# EAGLE design espslider (EAGLE 7.6.0)
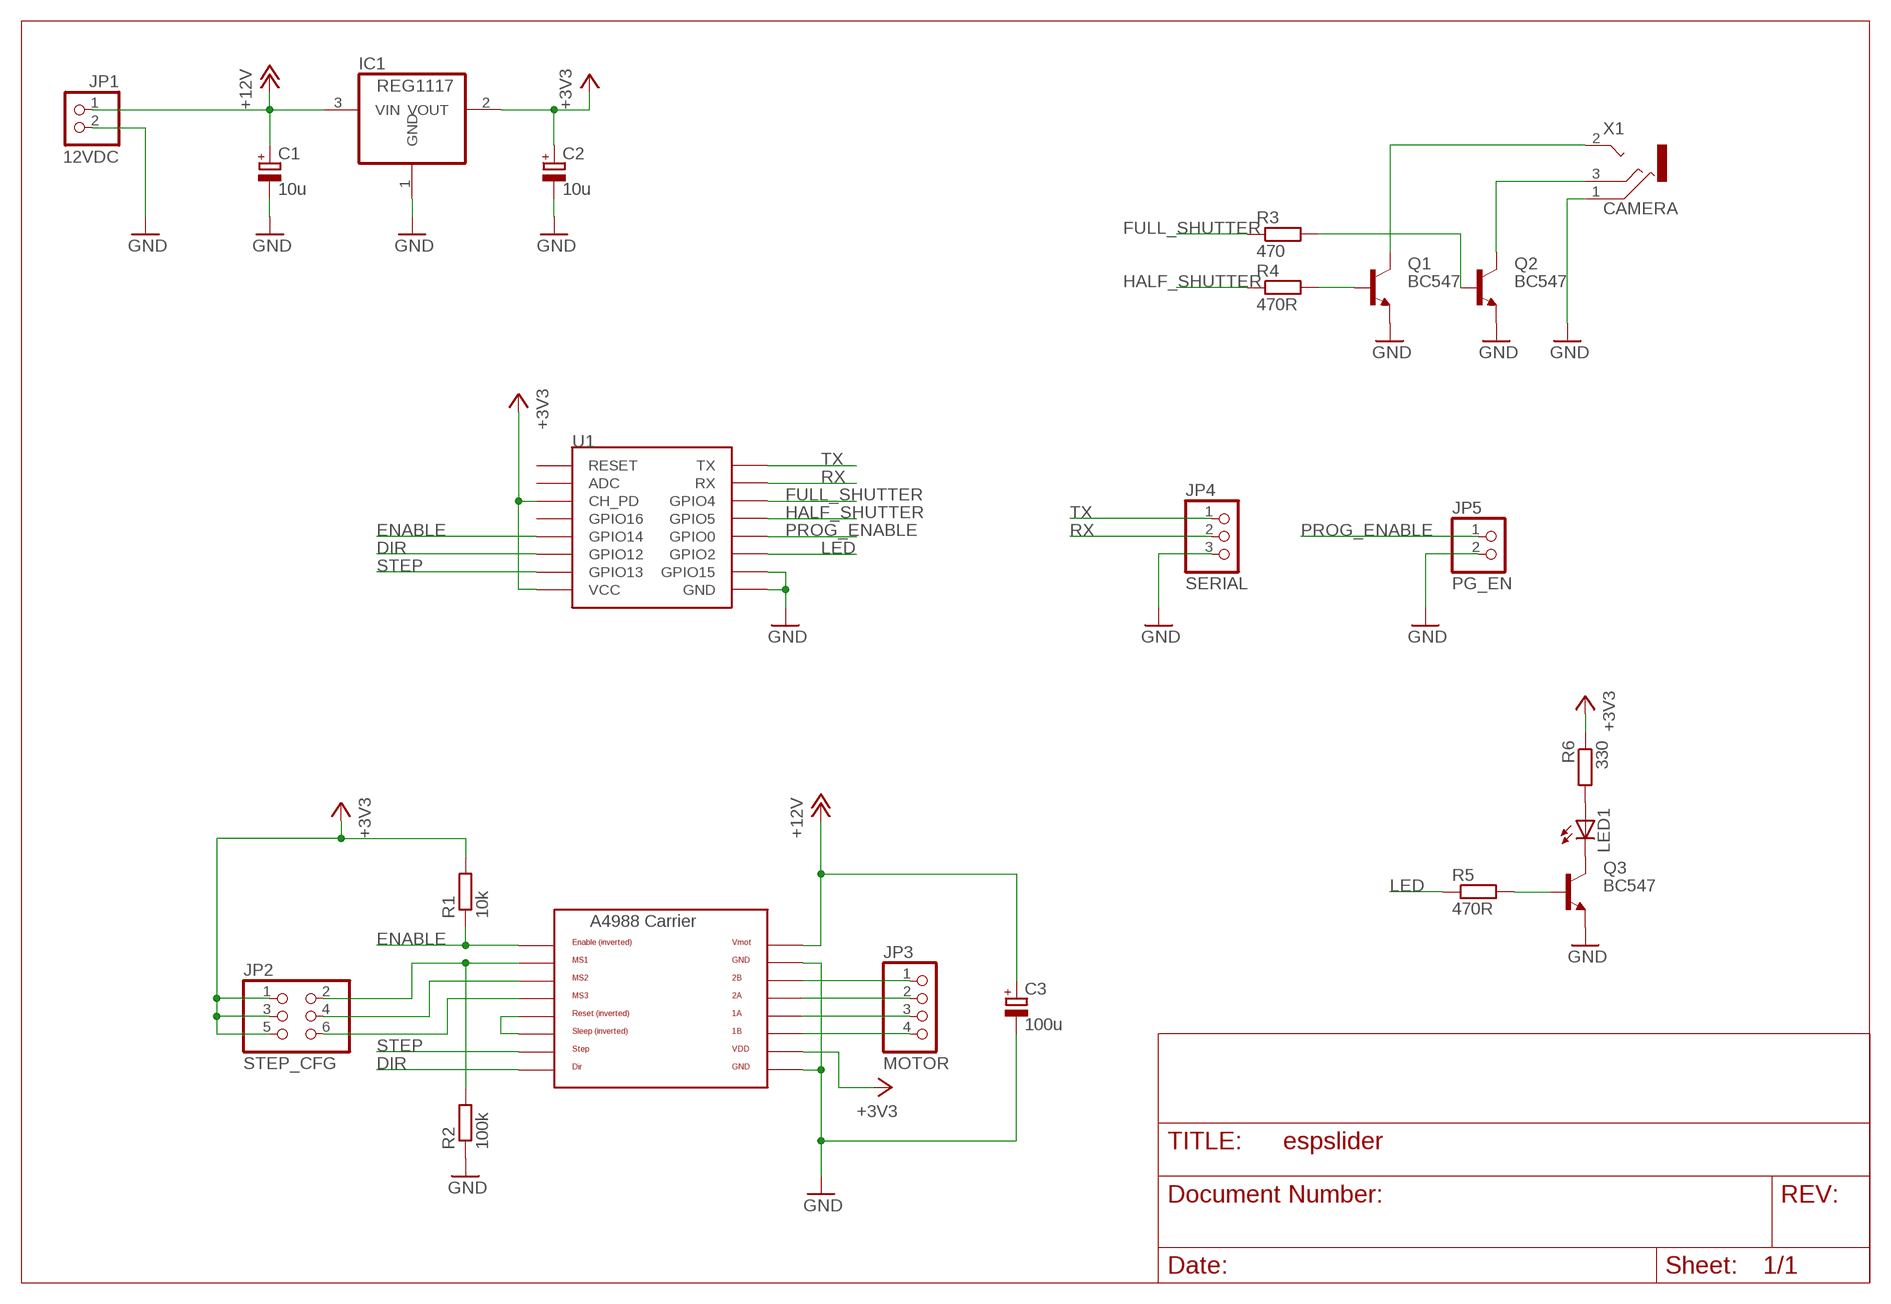
[diagram p0: schematic, sheet 1]

## Parts
C1  10u  CPOL-EUE5-5  [E5-5]
C2  10u  CPOL-EUE5-5  [E5-5]
C3  100u  CPOL-EUE5-5  [E5-5]
IC1  REG1117  [SOT223]
JP1  12VDC  PINHD-1X2  [1X02]
JP2  STEP_CFG  PINHD-2X3  [2X03]
JP3  MOTOR  PINHD-1X4  [1X04]
JP4  SERIAL  PINHD-1X3  [1X03]
JP5  PG_EN  PINHD-1X2  [1X02]
LED1  LED3MM  [LED3MM]
Q1  BC547  [TO92]
Q2  BC547  [TO92]
Q3  BC547  [TO92]
R1  10k  R-EU_0207/7  [0207/7]
R2  100k  R-EU_0207/15  [0207/15]
R3  470  R-EU_0207/7  [0207/7]
R4  470R  R-EU_0207/7  [0207/7]
R5  470R  R-EU_0207/7  [0207/7]
R6  330  R-EU_0207/7  [0207/7]
U1  ESP12SMD  [ESP12-SMD]
U2  A4988BREAKOUT  [A4988BREAKOUT]
X1  CAMERA  1501_04  [1501_05]

## Nets
+3V3: C2.+ IC1.2(VOUT) JP2.1 JP2.3 JP2.5 R1.2 R6.1 U1.CH_PD U1.VCC U2.VDD
+12V: C1.+ C3.+ IC1.3(VIN) JP1.1 U2.VMOT
DIR: U1.GPIO12 U2.DIR
ENABLE: R1.1 U1.GPIO14 U2.EN
FULL_SHUTTER: R3.1 U1.GPIO4
GND: C1.- C2.- C3.- IC1.1(GND) JP1.2 JP4.3 JP5.2 Q1.1(E) Q2.1(E) Q3.1(E) R2.1 U1.GND U1.GPIO15 U2.GND U2.GND@0(GND) X1.1
HALF_SHUTTER: R4.1 U1.GPIO5
LED: R5.1 U1.GPIO2
N$1: Q2.3(C) X1.3
N$2: Q2.2(B) R3.2
N$3: Q1.2(B) R4.2
N$4: Q1.3(C) X1.2
N$5: JP2.2 R2.2 U2.MS1
N$6: JP2.4 U2.MS2
N$7: JP2.6 U2.MS3
N$8: LED1.A R6.2
N$9: U2.RST U2.SLP(SLEEP)
N$10: JP3.1 U2.2B
N$11: JP3.2 U2.2A
N$12: JP3.3 U2.1A
N$13: JP3.4 U2.1B
N$14: LED1.K(C) Q3.3(C)
N$15: Q3.2(B) R5.2
PROG_ENABLE: JP5.1 U1.GPIO0
RX: JP4.2 U1.RXD0(RX)
STEP: U1.GPIO13 U2.STEP
TX: JP4.1 U1.TXD0(TX)
Unconnected: U1.ADC U1.GPIO16 U1.RESET

## Library data of the parts
C1 C2 = rcl:CPOL-EU: POLARIZED CAPACITOR, European symbol; MF: KEMET; MPN: T491C107K010AT; OC_NEWARK: 97H5564
C3 = rcl:CPOL-EU: POLARIZED CAPACITOR, European symbol; OC_NEWARK: unknown
IC1 = burr-brown:REG1117: 800mA and 1A Low Dropout (LDO) Positive Regulator 1.8V, 2.5V, 2.85V, 3.3V, 5V, and Adj; MPN: REG1117; OC_FARNELL: 1097566; OC_NEWARK: 14P6981
JP1 JP5 = pinhead:PINHD-1X2: PIN HEADER; OC_NEWARK: unknown
JP2 = pinhead:PINHD-2X3: PIN HEADER; OC_NEWARK: unknown
JP3 = pinhead:PINHD-1X4: PIN HEADER; OC_NEWARK: unknown
JP4 = pinhead:PINHD-1X3: PIN HEADER; OC_NEWARK: unknown
LED1 = led:LED: LED OSRAM: - CHIPLED LG R971, LG N971, LY N971, LG Q971, LY Q971, LO R971, LY R971 LH N974, LH R974 LS Q976, LO Q976, LY Q976 LO Q996 - Hyper CHIPLED LW Q18S LB Q993, LB Q99A, LB R99A - SideLED LS A670, LO A670, LY A670, LG A670, LP A670 LB A673, LV A673, LT A673, LW A673 LH A674 LY A675 LS A676, LA A676, LO A676, LY A676, LW A676 LS A679, LY A679, LG A679 - Hyper Micro SIDELED® LS Y876, LA Y876, LO Y876, LY Y876 LT Y87S - SmartLED LW L88C, LW L88S LB L89C, LB L89S, LG L890 LS L89K, LO L89K, LY L89K LS L896, LA L896, LO L896, LY L896 - TOPLED LS T670, LO T670, LY T670, LG T670, LP T670 LSG T670, LSP T670, LSY T670, LOP T670, LYG T670 LG T671, LOG T671, LSG T671 LB T673, LV T673, LT T673, LW T673 LH T674 LS T676, LA T676, LO T676, LY T676, LB T676, LH T676, LSB T676, LW T676 LB T67C, LV T67C, LT T67C, LS T67K, LO T67K, LY T67K, LW E67C LS E67B, LA E67B, LO E67B, LY E67B, LB E67C, LV E67C, LT E67C LW T67C LS T679, LY T679, LG T679 LS T770, LO T770, LY T770, LG T770, LP T770 LB T773, LV T773, LT T773, LW T773 LH T774 LS E675, LA E675, LY E675, LS T675 LS T776, LA T776, LO T776, LY T776, LB T776 LHGB T686 LT T68C, LB T68C - Hyper Mini TOPLED® LB M676 - Mini TOPLED Santana® LG M470 LS M47K, LO M47K, LY M47K Source: http://www.osram.convergy.de LUXEON: - LUMILED® LXK2-PW12-R00, LXK2-PW12-S00, LXK2-PW14-U00, LXK2-PW14-V00 LXK2-PM12-R00, LXK2-PM12-S00, LXK2-PM14-U00 LXK2-PE12-Q00, LXK2-PE12-R00, LXK2-PE12-S00, LXK2-PE14-T00, LXK2-PE14-U00 LXK2-PB12-K00, LXK2-PB12-L00, LXK2-PB12-M00, LXK2-PB14-N00, LXK2-PB14-P00, LXK2-PB14-Q00 LXK2-PR12-L00, LXK2-PR12-M00, LXK2-PR14-Q00, LXK2-PR14-R00 LXK2-PD12-Q00, LXK2-PD12-R00, LXK2-PD12-S00 LXK2-PH12-R00, LXK2-PH12-S00 LXK2-PL12-P00, LXK2-PL12-Q00, LXK2-PL12-R00 Source: www.luxeon.com KINGBRIGHT: KA-3528ASYC Source: www.kingbright.com; OC_NEWARK: unknown
Q1-Q3 = transistor-npn:BC547*: NPN Transistor; OC_NEWARK: unknown
R1-R6 = rcl:R-EU_: RESISTOR, European symbol; OC_NEWARK: unknown
U1 = esp8266modules:ESP12: ESP8266 Wifi module 12; OC_NEWARK: unknown
U2 = RepRapjr:A4988BREAKOUT; OC_NEWARK: unknown
X1 = con-lumberg:1501_0*: Jack connectors according to JISC 6560, 2.5 mm Klinkensteckverbinder nach JISC 6560, 2,5 mm Source: http://www.lumberg.com/Produkte/PDFs/1501_05.pdfedit 1501_03 http://www.lumberg.com/Produkte/PDFs/1501_06.pdf; OC_FARNELL: 1216977; OC_NEWARK: unknown

## Board
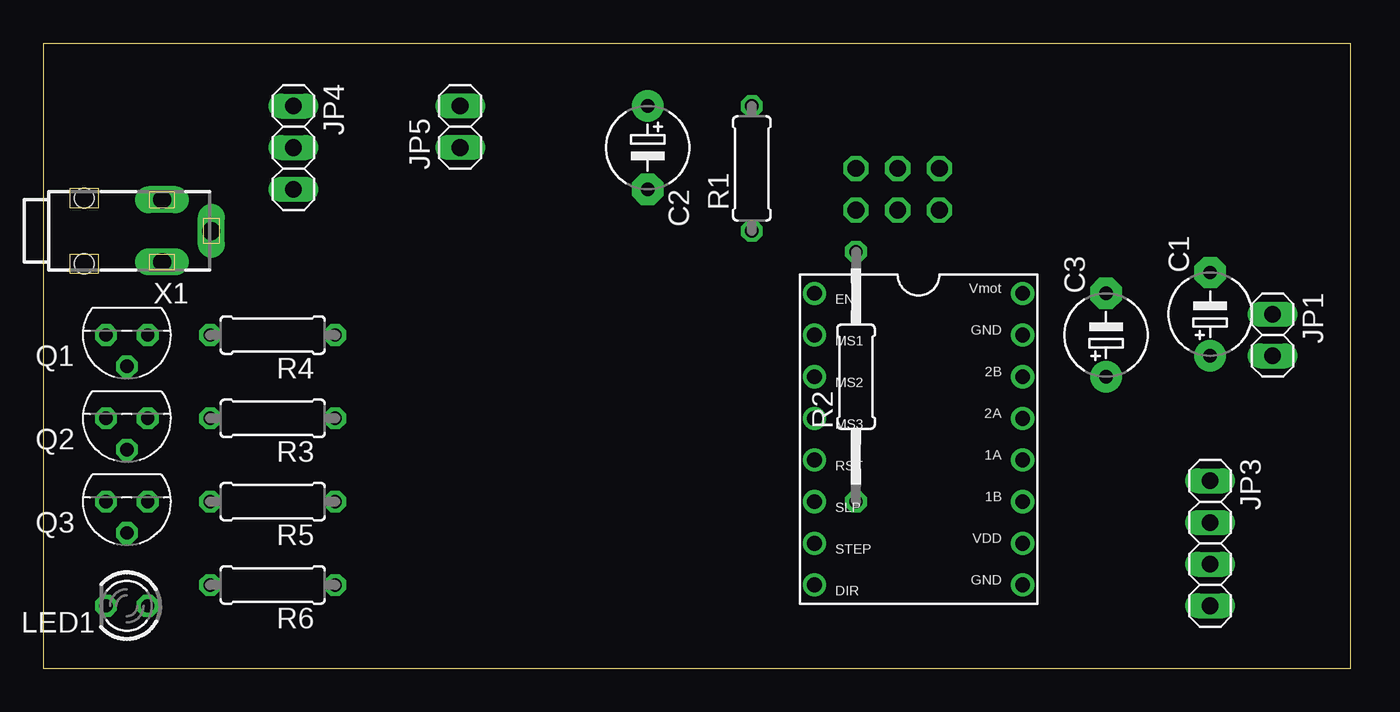
[diagram p1: board, top side]
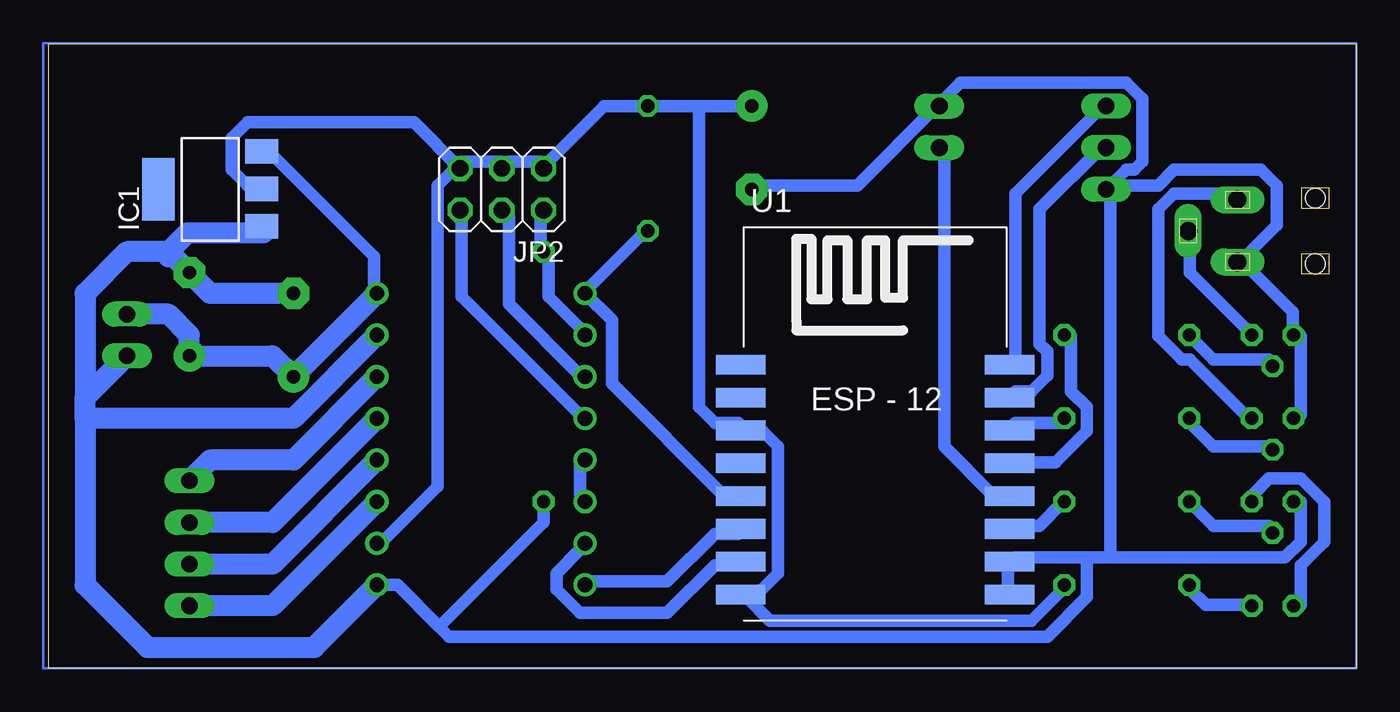
[diagram p2: board, bottom side, seen from below]

Size 79.68 x 38.09 mm. Coordinates in mm from the lower left corner, seen from the top.
Outline: 0,0 79.68,0 79.68,38.09 0,38.09 0,0
Copper layers (1*16): Top 0.035mm / dielectric 1.5mm / Bottom 0.035mm
Design rules "default *": minimum track width 30mil, minimum drill 24mil, track to track 8mil, track to pad 8mil, pad to pad 8mil, via to via 8mil, smd to smd 8mil, copper to edge 40mil, drill to drill 8mil, minimum pad ring 10mil, minimum via ring 8mil, stop-mask expansion 4mil, vias tented up to drill 0mil, thermal gap 10mil

### Footprints (pad centres in the part's own frame; a part is rotated, then mirrored left to right if it is on the bottom)
E5-5 = drill 0.813 pad 1.905: + -2.54,0 | drill 0.813 pad 1.905 octagon: - 2.54,0
SOT223 = smd 1.499 x 2.007: 1 -2.261,-3.15; 2 0.025,-3.15; 3 2.311,-3.15 | smd 3.81 x 2.007: 4 0,3.15
1X02 = drill 1.016 long: 1 -1.27,0; 2 1.27,0
2X03 = drill 1.016 octagon: 1 -2.54,-1.27; 2 -2.54,1.27; 3 0,-1.27; 4 0,1.27; 5 2.54,-1.27; 6 2.54,1.27
1X04 = drill 1.016 long: 1 -3.81,0; 2 -1.27,0; 3 1.27,0; 4 3.81,0
1X03 = drill 1.016 long: 1 -2.54,0; 2 0,0; 3 2.54,0
LED3MM = drill 0.813 octagon: A -1.27,0; K 1.27,0
TO92 = drill 0.813 octagon: 1 1.27,0; 2 0,1.905; 3 -1.27,0
0207/7 = drill 0.813 octagon: 1 -3.81,0; 2 3.81,0
0207/15 = drill 0.813 octagon: 1 -7.62,0; 2 7.62,0
ESP12-SMD = smd 3 x 1.2: ADC -8.3,3.8; CH_PD -8.3,1.8; GND 8.1,-8.2; GPIO0 8.1,-2.2; GPIO2 8.1,-4.2; GPIO4 8.1,1.8; GPIO5 8.1,-0.2; GPIO12 -8.3,-4.2; GPIO13 -8.3,-6.2; GPIO14 -8.3,-2.2; GPIO15 8.1,-6.2; GPIO16 -8.3,-0.2; RESET -8.3,5.8; RXD0 8.1,3.8; TXD0 8.1,5.8; VCC -8.3,-8.2
A4988BREAKOUT = drill 0.9: 1A 8.89,1.27; 1B 11.43,1.27; 2A 6.35,1.27; 2B 3.81,1.27; DIR 16.51,-11.43; EN -1.27,-11.43; GND 16.51,1.27; GND@0 1.27,1.27; MS1 1.27,-11.43; MS2 3.81,-11.43; MS3 6.35,-11.43; RST 8.89,-11.43; SLP 11.43,-11.43; STEP 13.97,-11.43; VDD 13.97,1.27; VMOT -1.27,1.27
1501_05 = drill 1.1 pad 1.4 long: 1 -1.9,-8.5; 2 0,-11.5; 3 1.9,-8.5 | hole 1.2: -2,-3.75; 2,-3.75

### Placement (x,y rotation side)
C1  71.12,21.59 90 top
C2  36.83,31.75 270 top
C3  64.77,20.32 90 top
IC1  69.85,29.21 90 bottom
JP1  74.93,20.32 270 top
JP2  52.07,29.21 180 bottom
JP3  71.12,7.62 270 top
JP4  15.24,31.75 270 top
JP5  25.4,33.02 90 top
LED1  5.08,3.81 180 top
Q1  5.08,20.32 180 top
Q2  5.08,15.24 180 top
Q3  5.08,10.16 180 top
R1  43.18,30.48 90 top
R2  49.53,17.78 90 top
R3  13.97,15.24 180 top
R4  13.97,20.32 180 top
R5  13.97,10.16 180 top
R6  13.97,5.08 180 top
U1  29.21,12.7 0 bottom
U2  58.42,21.59 270 top
X1  -1.27,26.67 90 top

### Tracks (layer width: path | path; a pad name or v marks a point on that pad's centre or on a via)
+3V3
  Bottom 0.762: R6.1 17.86,4.83 19.79,2.9 35.71,2.9 37.16,4.34 U1.VCC 36.68,4.34 35.23,5.79 35.23,13.51 36.2,14.48 37.16,14.48 U1.CH_PD 37.64,14.96 39.09,14.96 40.06,15.93 40.06,34.27 | 40.06,34.27 37.16,34.27 C2.+ | 40.06,34.27 42.95,34.27 R1.2 43.43,34.27 45.85,34.27 49.23,30.89 JP2.1 49.71,30.89 51.64,30.89 JP2.3 52.12,30.89 54.53,30.89 JP2.5 | JP2.5 57.43,33.3 67.56,33.3 68.53,32.33 68.53,30.4 67.56,29.44 67.08,29.44 IC1.2 | U2.VDD 59.36,7.72 55.98,11.1 55.98,29.44 55.02,30.4 JP2.5
+12V
  Bottom 0.762: IC1.3 66.6,31.37 66.12,31.37 59.84,25.09 59.84,23.16 U2.VMOT
  Bottom 1.27: U2.VMOT C3.+ 66.04,19.05 C1.+ 71.12,20.32 72.39,21.59 JP1.1
DIR
  Bottom 0.762: U2.DIR 46.81,5.31 41.99,5.31 39.09,8.2 37.64,8.2 U1.GPIO12
ENABLE
  Bottom 0.762: R1.1 43.43,26.54 46.81,23.16 U2.EN 45.36,21.23 45.36,17.37 38.61,10.62 37.64,10.62 U1.GPIO14
FULL_SHUTTER
  Bottom 0.762: R3.1 17.86,14.96 20.75,14.96 U1.GPIO4
GND
  Bottom 0.762: 16.41,6.76 20.75,6.76 U1.GPIO15 21.23,6.27 21.23,4.83 U1.GND | 16.41,6.76 14.96,6.76 | 14.96,6.76 4.34,6.76 3.38,7.72 3.38,10.13 Q3.1 | Q2.1 3.38,15.44 3.38,20.27 Q1.1 3.86,20.75 3.86,21.72 6.76,24.61 X1.1 6.76,25.09 4.83,27.03 4.83,29.44 5.79,30.4 11.1,30.4 12.06,29.44 14.96,29.44 | 14.96,6.76 14.96,28.96 JP4.3 14.96,29.44 | 66.6,26.54 IC1.1 | 14.96,29.44 13.99,30.4 13.51,30.4 13.03,30.89 13.03,34.75 13.99,35.71 24.13,35.71 25.09,34.75 JP5.2 25.58,34.27 30.4,29.44 36.68,29.44 C2.- | 16.41,6.76 16.41,4.34 18.82,1.93 55.27,1.93 55.88,2.54 | 72.39,25.09 72.39,25.4 | R2.1 49.53,8.89 55.88,2.54 | U2.GND 58.42,5.08 55.88,2.54
  Bottom 1.27: 77.47,15.24 77.47,5.08 73.66,1.27 63.5,1.27 U2.GND | U2.GND@0 64.77,15.24 77.47,15.24 | 77.47,15.24 77.47,16.51 | 77.47,16.51 JP1.2 | 66.6,26.54 71.25,26.54 72.39,25.4 74.93,25.4 77.47,22.86 77.47,16.51 | 72.39,25.09 72.08,25.09 C1.- 69.85,22.86 C3.-
HALF_SHUTTER
  Bottom 0.762: R4.1 17.37,20.27 17.37,16.89 16.41,15.93 16.41,14.48 18.34,12.55 20.75,12.55 U1.GPIO5
LED
  Bottom 0.762: R5.1 17.86,10.13 19.3,8.69 20.75,8.69 U1.GPIO2
N$1
  Bottom 0.762: Q2.3 6.76,15.44 10.13,18.82 10.62,18.82 12.06,20.27 12.06,27.99 11.1,28.96 7.24,28.96 X1.3
N$2
  Bottom 0.762: Q2.2 5.31,13.51 8.69,13.51 10.13,14.96 R3.2
N$3
  Bottom 0.762: Q1.2 5.31,18.82 8.69,18.82 10.13,20.27 R4.2
N$4
  Bottom 0.762: Q1.3 6.76,20.75 10.13,24.13 10.13,26.54 X1.2
N$5
  Bottom 0.762: JP2.2 49.71,27.51 49.71,25.58 R2.2 49.23,25.09 49.23,22.68 47.3,20.75 U2.MS1
N$6
  Bottom 0.762: U2.MS2 47.3,17.86 51.64,22.2 51.64,27.51 JP2.4
N$7
  Bottom 0.762: U2.MS3 47.3,15.44 54.53,22.68 54.53,27.51 JP2.6
N$8
  Bottom 0.762: LED1.A 6.76,3.86 9.17,3.86 10.13,4.83 R6.2
N$9
  Bottom 0.762: U2.SLP 47.3,10.62 47.3,12.55 U2.RST
N$10
  Bottom 1.27: U2.2B 64.77,12.7 69.85,12.7 JP3.1
N$11
  Bottom 1.27: U2.2A 66.04,8.89 JP3.2
N$12
  Bottom 1.27: U2.1A 66.04,6.35 JP3.3
N$13
  Bottom 1.27: U2.1B 66.04,3.81 JP3.4
N$14
  Bottom 0.762: LED1.K 3.38,3.86 3.38,6.27 1.93,7.72 1.93,10.13 3.38,11.58 5.31,11.58 6.27,10.62 Q3.3
N$15
  Bottom 0.762: R5.2 8.69,8.69 5.31,8.69 Q3.2
PROG_ENABLE
  Bottom 0.762: U1.GPIO0 21.23,10.62 22.2,10.62 25.09,13.51 25.09,31.37 JP5.1
RX
  Bottom 0.762: U1.RXD0 20.75,16.89 19.79,16.89 18.82,17.86 18.82,19.3 19.3,19.79 19.3,27.99 15.44,31.85 JP4.2
S$1
  Bottom 0.15: 0,38.1 80.01,38.1 80.01,0 0,0 0,38.1
STEP
  Bottom 0.762: U2.STEP 47.3,7.24 48.74,5.79 48.74,4.83 47.3,3.38 41.99,3.38 39.09,6.27 37.64,6.27 U1.GPIO13
TX
  Bottom 0.762: U1.TXD0 20.75,18.82 20.75,28.96 15.44,34.27 JP4.1